# Altium project uart-keyboard.PrjPcb
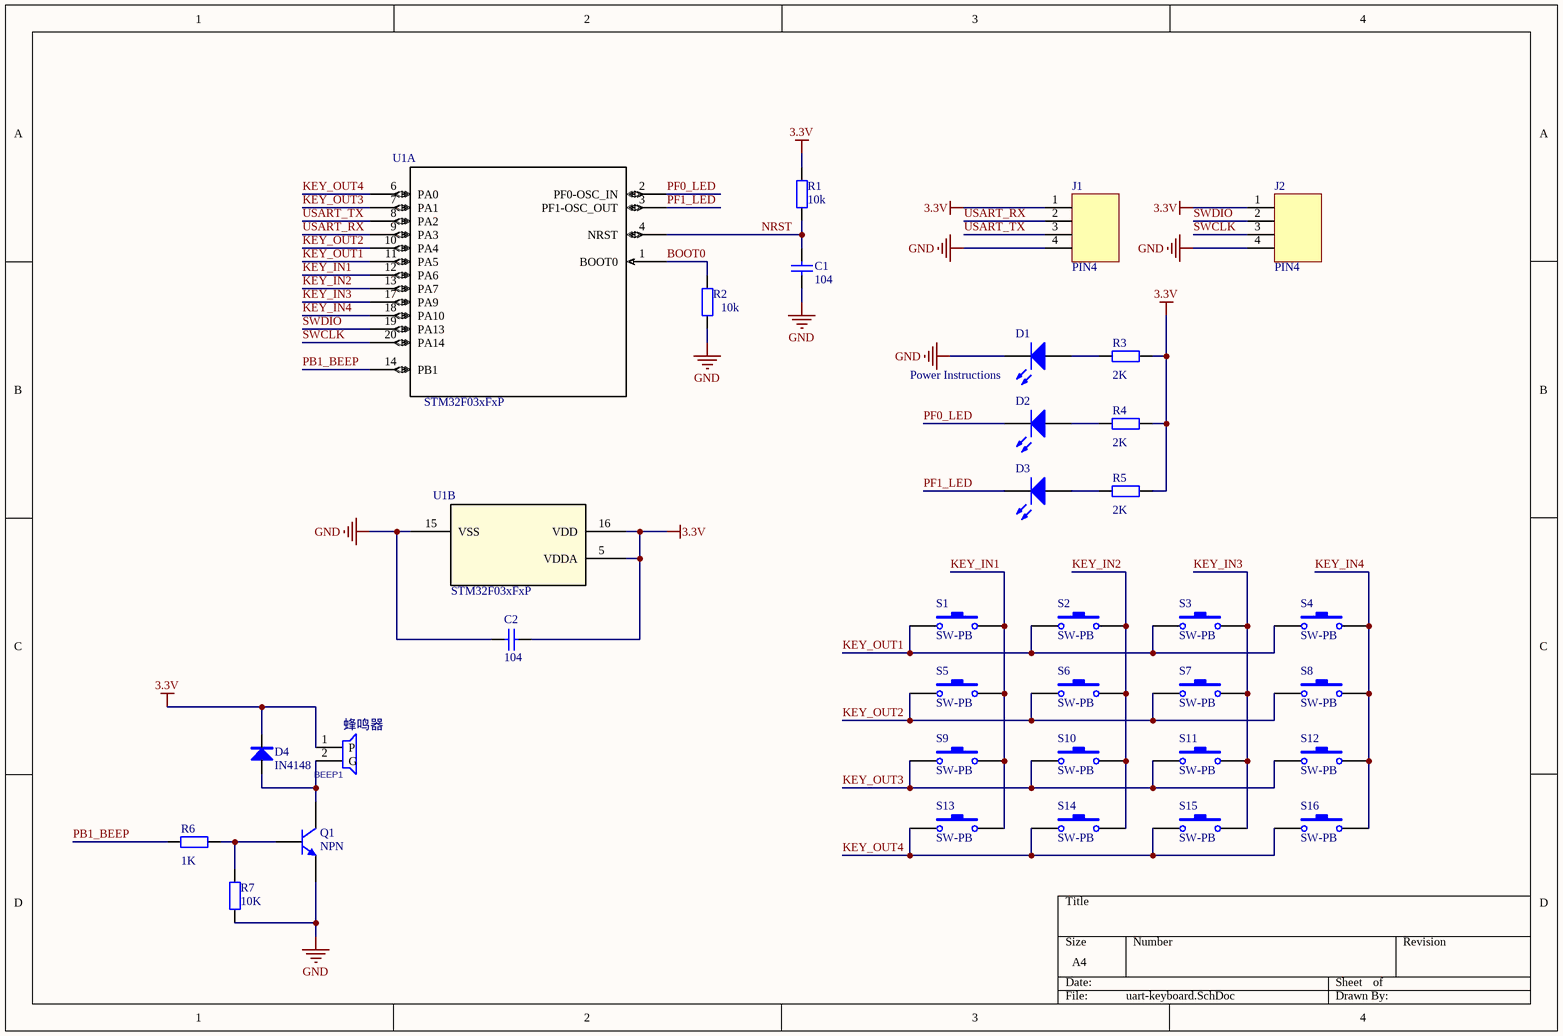
[diagram p0: uart-keyboard.SchDoc]
1 sheet, 34 parts. Net scope: global (net labels, ports and power ports of the same name join across sheets).
Board file: uart-keyboard.PcbDoc

## Sheet uart-keyboard.SchDoc
size A4

### Parts
BEEP1  BEEP-9.5X5.5  [蜂鸣器]  (value not drawn)
C1  value 104  [0805C]
C2  value 104  [0805C]
D1  Power Instructions  [LED0805]
D2  (no value)  [LED0805]
D3  (no value)  [LED0805]
D4  IN4148  [D4148]
J1  PIN4  [排针1*4-2.54-直]
J2  PIN4  [排针1*4-2.54-直]
Q1  NPN  [SOT-23-3]
R1  value 10k  [0805R]
R2  value 10k  [0805R]
R3  value 2K  [0805R]
R4  value 2K  [0805R]
R5  value 2K  [0805R]
R6  value 1K  [0805R]
R7  value 10K  [0805R]
S1  SW-PB  [轻触开关-6*6*5]
S2  SW-PB  [轻触开关-6*6*5]
S3  SW-PB  [轻触开关-6*6*5]
S4  SW-PB  [轻触开关-6*6*5]
S5  SW-PB  [轻触开关-6*6*5]
S6  SW-PB  [轻触开关-6*6*5]
S7  SW-PB  [轻触开关-6*6*5]
S8  SW-PB  [轻触开关-6*6*5]
S9  SW-PB  [轻触开关-6*6*5]
S10  SW-PB  [轻触开关-6*6*5]
S11  SW-PB  [轻触开关-6*6*5]
S12  SW-PB  [轻触开关-6*6*5]
S13  SW-PB  [轻触开关-6*6*5]
S14  SW-PB  [轻触开关-6*6*5]
S15  SW-PB  [轻触开关-6*6*5]
S16  SW-PB  [轻触开关-6*6*5]
U1  STM32F03xFxP  [TSSOP20]  (parts A,B of 2)

### Nets
3.3V: BEEP1.1(P) C2.1 D4.2(K) J1.1 J2.1 R1.1 R3.2 R4.2 R5.2 U1.5(VDDA) U1.16(VDD)
GND: C1.1 C2.2 D1.2(K) J1.4 J2.4 Q1.E R2.2 R7.1 U1.15(VSS)
BOOT0: R2.1 U1.1(BOOT0)
KEY_IN1: S1.2 S5.2 S9.2 S13.2 U1.12(PA6)
KEY_IN2: S2.2 S6.2 S10.2 S14.2 U1.13(PA7)
KEY_IN3: S3.2 S7.2 S11.2 S15.2 U1.17(PA9)
KEY_IN4: S4.2 S8.2 S12.2 S16.2 U1.18(PA10)
KEY_OUT1: S1.1 S2.1 S3.1 S4.1 U1.11(PA5)
KEY_OUT2: S5.1 S6.1 S7.1 S8.1 U1.10(PA4)
KEY_OUT3: S9.1 S10.1 S11.1 S12.1 U1.7(PA1)
KEY_OUT4: S13.1 S14.1 S15.1 S16.1 U1.6(PA0)
NRST: C1.2 R1.2 U1.4(NRST)
PB1_BEEP: R6.1 U1.14(PB1)
PF0_LED: D2.2(K) U1.2(PF0-OSC_IN)
PF1_LED: D3.2(K) U1.3(PF1-OSC_OUT)
SWCLK: J2.3 U1.20(PA14)
SWDIO: J2.2 U1.19(PA13)
USART_RX: J1.2 U1.9(PA3)
USART_TX: J1.3 U1.8(PA2)
NetBEEP1_2: BEEP1.2(G) D4.1(A) Q1.C
NetD1_1: D1.1(A) R3.1
NetD2_1: D2.1(A) R4.1
NetD3_1: D3.1(A) R5.1
NetQ1_B: Q1.B R6.2 R7.2

### Notes on the sheet
- (near BEEP1) 蜂鸣器

### Library data of the parts
C1 C2 = Cap: Capacitor; Published: 8-Jun-2000; LatestRevisionDate: 17-Jul-2002; LatestRevisionNote: Re-released for DXP Platform.; PackageReference: RAD-0.3; Publisher: Altium Limited; PackageDescription: Radial Cap, Thru-Hole; 2 Leads; 0.3 in Pin Spacing
D1-D3 = LED2: Typical RED, GREEN, YELLOW, AMBER GaAs LED; Published: 8-Jun-2000; LatestRevisionDate: 17-Jul-2002; LatestRevisionNote: Re-released for DXP Platform.; PackageVersion: Feb-2002; PackageReference: 3.2X1.6X1.1; Publisher: Altium Limited; PackageDescription: SM LED; 2 Flat Leads
Q1 = NPN: NPN Bipolar Transistor; Published: 8-Jun-2000; LatestRevisionDate: 17-Jul-2002; LatestRevisionNote: Re-released for DXP Platform.; PackageReference: TO-226-AA; Publisher: Altium Limited; PackageDescription: TO, Flat Index; 3 In-Line, Axial Leads; Body Dia. 4.8mm; Leads 0.55 x 0.51 mm (max); Code_JEDEC: TO-226-AA
R1-R7 = Res2: Resistor; Published: 8-Jun-2000; LatestRevisionDate: 17-Jul-2002; LatestRevisionNote: Re-released for DXP Platform.; PackageReference: AXIAL-0.4; Publisher: Altium Limited; PackageDescription: Axial Device, Thru-Hole; 2 Leads; 0.4 in Pin Spacing
S1-S16 = SW-PB: Switch; Published: 24-Mar-1999; LatestRevisionDate: 17-Jul-2002; LatestRevisionNote: Re-released for DXP Platform.; PackageReference: SPST-2; Publisher: Altium Limited; PackageDescription: Switch; 2 Leads
U1 = STM32F03xFxP: Imported; Vendor: STMicroelectronics; C: Copyright (C) 2016 Accelerated Designs. All rights reserved; Copyright: Copyright (C) 2016 Accelerated Designs. All rights reserved; Manufacturer_Part_Number: stm32f03xfxp; RefDes: RefDes; Type: Type; Value: Value
BEEP1 = BEEP-9.5X5.5: PCB DECAL: BEEP-9.5X5.5